# Altium schematic sheet Power.SchDoc
size B; Organization: Mechanart, LLC; Address1: 397 Laurie Meadows Drive; Address2: Apt. 437; Address3: San Mateo, CA 94403
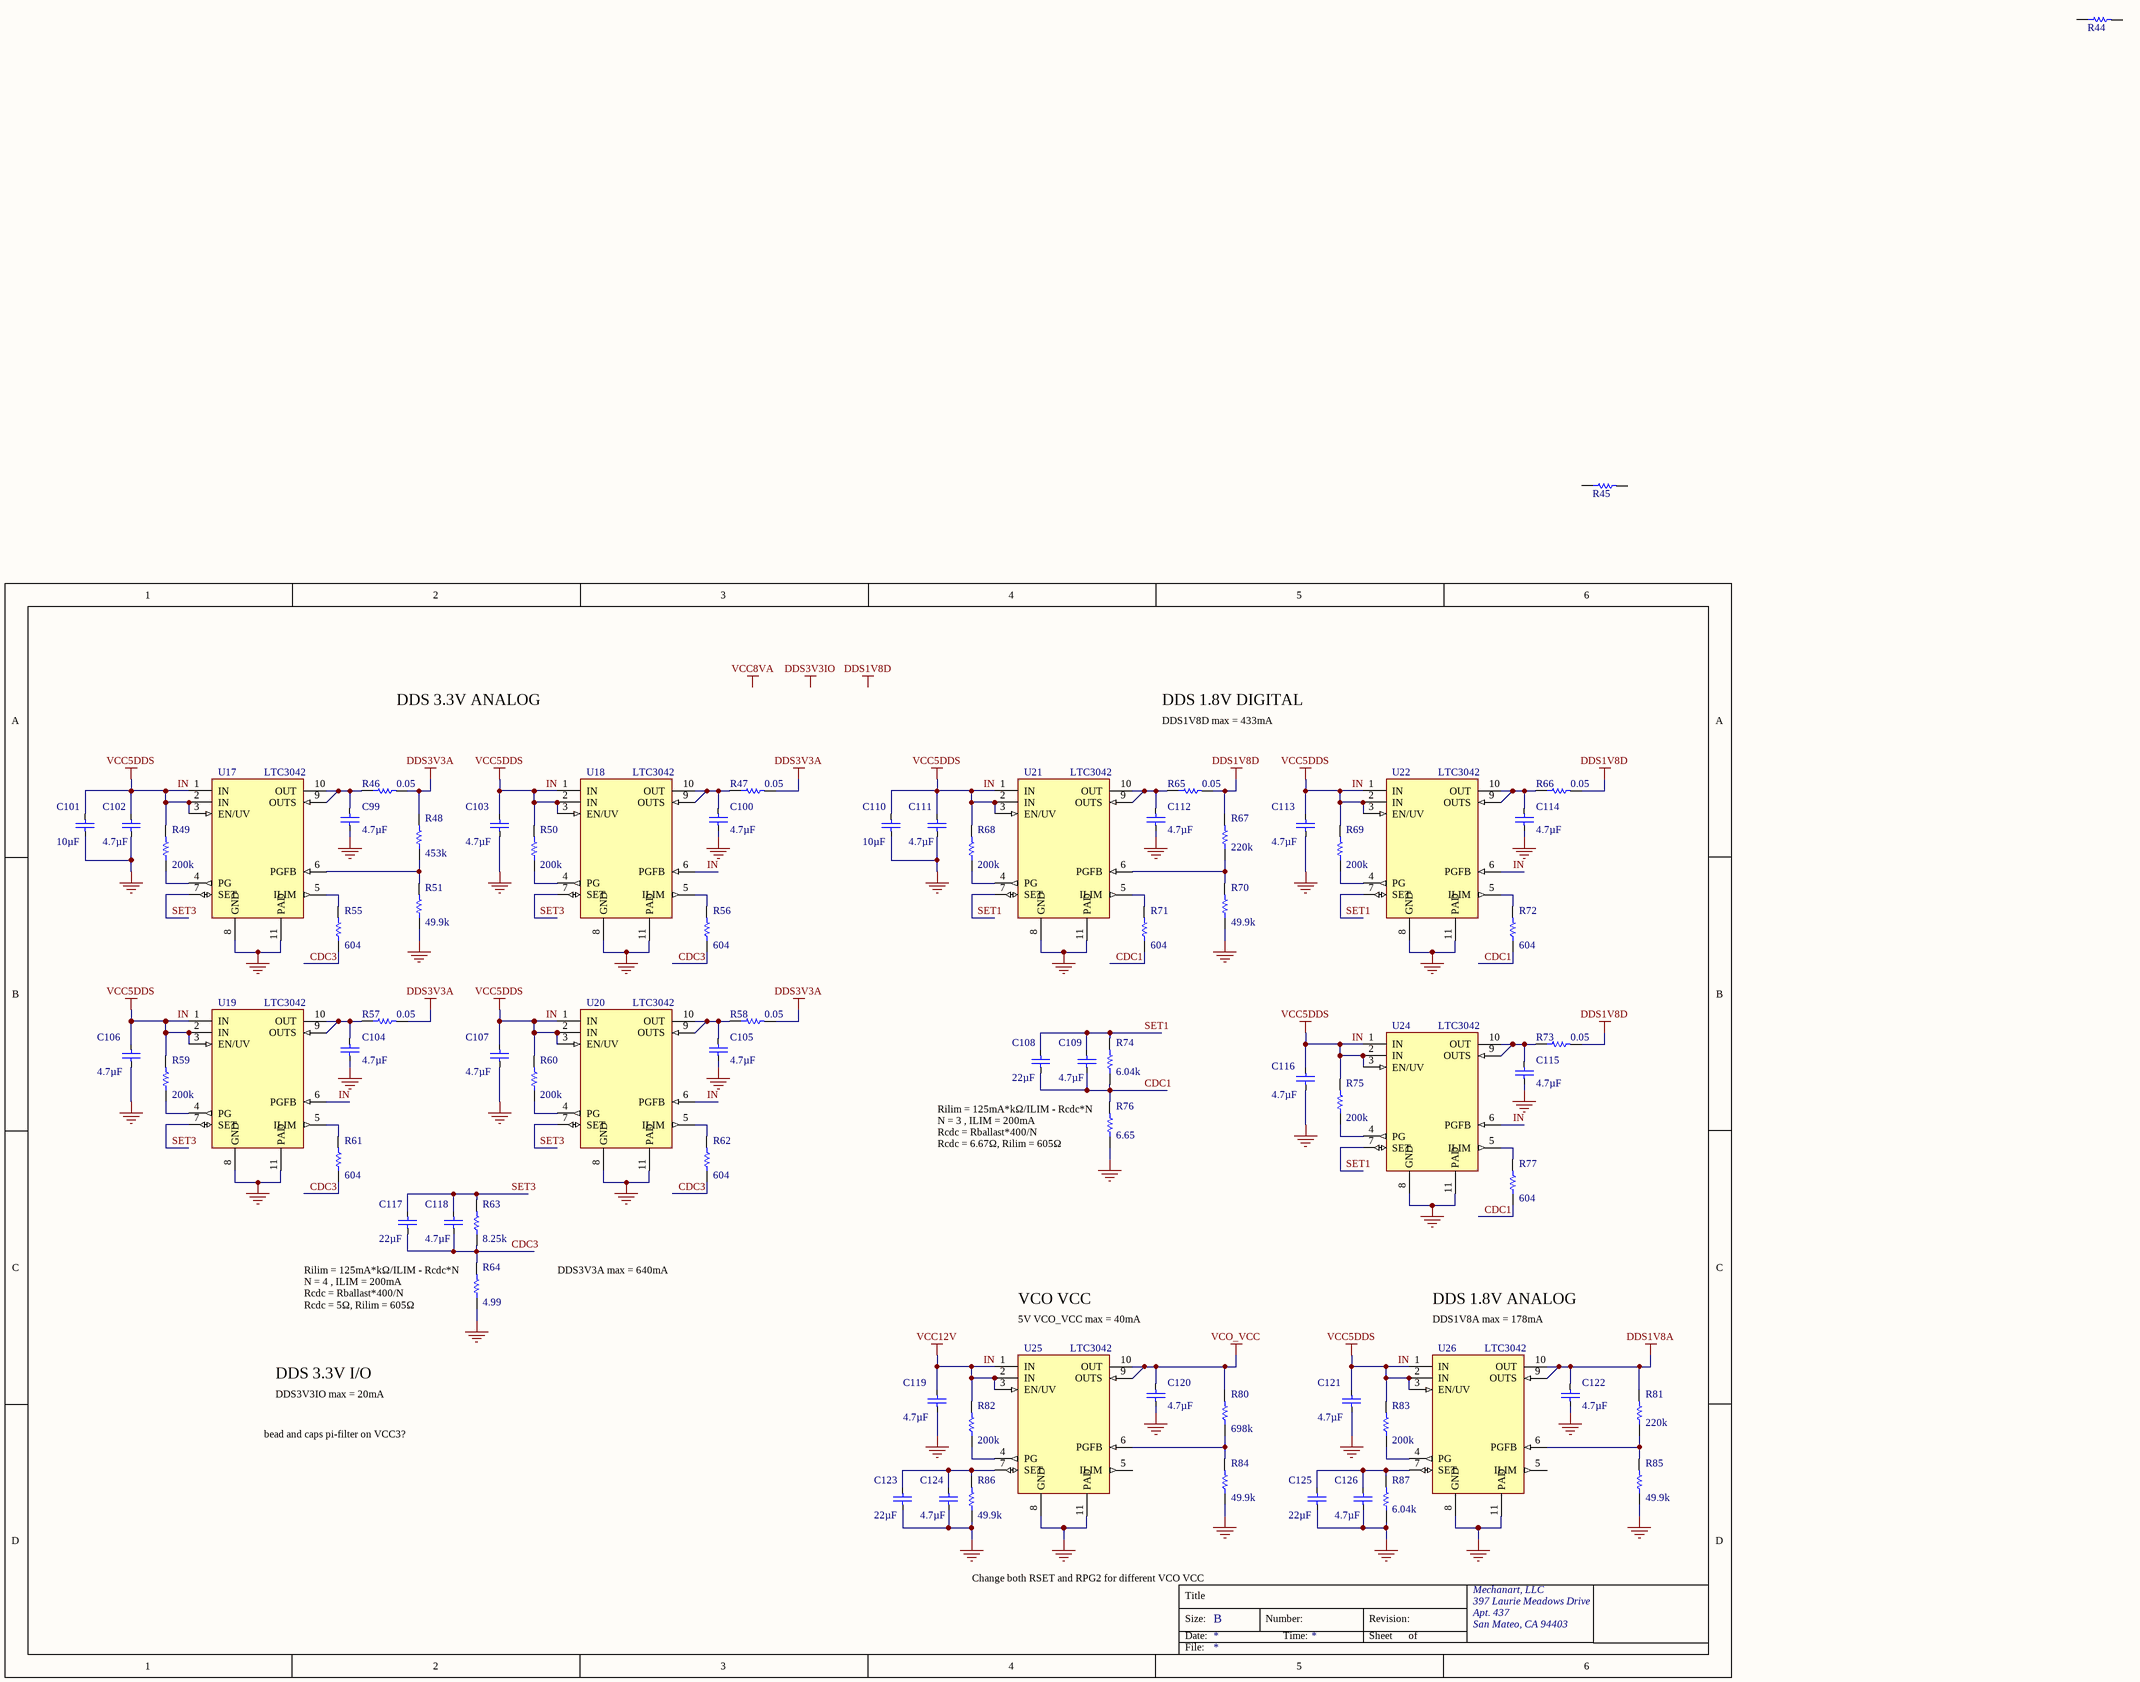
[diagram p0: Power.SchDoc]

## Parts
C99  4.7µF  [CAPC3216X160L55N]
C100  4.7µF  [CAPC3216X160L55N]
C101  10µF  [CAPC3216X160L55N]
C102  4.7µF  [CAPC3216X160L55N]
C103  4.7µF  [CAPC3216X160L55N]
C104  4.7µF  [CAPC3216X160L55N]
C105  4.7µF  [CAPC3216X160L55N]
C106  4.7µF  [CAPC3216X160L55N]
C107  4.7µF  [CAPC3216X160L55N]
C108  22µF  [CAPC2012X145L30N]
C109  4.7µF  [CAPC3216X160L55N]
C110  10µF  [CAPC3216X160L55N]
C111  4.7µF  [CAPC3216X160L55N]
C112  4.7µF  [CAPC3216X160L55N]
C113  4.7µF  [CAPC3216X160L55N]
C114  4.7µF  [CAPC3216X160L55N]
C115  4.7µF  [CAPC3216X160L55N]
C116  4.7µF  [CAPC3216X160L55N]
C117  22µF  [CAPC2012X145L30N]
C118  4.7µF  [CAPC3216X160L55N]
C119  4.7µF  [CAPC3216X160L55N]
C120  4.7µF  [CAPC3216X160L55N]
C121  4.7µF  [CAPC3216X160L55N]
C122  4.7µF  [CAPC3216X160L55N]
C123  22µF  [CAPC2012X145L30N]
C124  4.7µF  [CAPC3216X160L55N]
C125  22µF  [CAPC2012X145L30N]
C126  4.7µF  [CAPC3216X160L55N]
R44  0.05  [RESC_2012[0805]_N]  (value not drawn)
R45  8.25k  [RESC1608X45L30N]  (value not drawn)
R46  0.05  [RESC_2012[0805]_N]
R47  0.05  [RESC_2012[0805]_N]
R48  453k  [RESC1608X45L30N]
R49  200k  [RESC1608X45L30N]
R50  200k  [RESC1608X45L30N]
R51  49.9k  [RESC1608X45L30N]
R55  604  [RESC1608X45L30N]
R56  604  [RESC1608X45L30N]
R57  0.05  [RESC_2012[0805]_N]
R58  0.05  [RESC_2012[0805]_N]
R59  200k  [RESC1608X45L30N]
R60  200k  [RESC1608X45L30N]
R61  604  [RESC1608X45L30N]
R62  604  [RESC1608X45L30N]
R63  8.25k  [RESC1608X45L30N]
R64  4.99  [RESC1608X45L30N]
R65  0.05  [RESC_2012[0805]_N]
R66  0.05  [RESC_2012[0805]_N]
R67  220k  [RESC1608X45L30N]
R68  200k  [RESC1608X45L30N]
R69  200k  [RESC1608X45L30N]
R70  49.9k  [RESC1608X45L30N]
R71  604  [RESC1608X45L30N]
R72  604  [RESC1608X45L30N]
R73  0.05  [RESC_2012[0805]_N]
R74  6.04k  [RESC1608X45L30N]
R75  200k  [RESC1608X45L30N]
R76  6.65  [RESC1608X45L30N]
R77  604  [RESC1608X45L30N]
R80  698k  [RESC1608X45L30N]
R81  220k  [RESC1608X45L30N]
R82  200k  [RESC1608X45L30N]
R83  200k  [RESC1608X45L30N]
R84  49.9k  [RESC1608X45L30N]
R85  49.9k  [RESC1608X45L30N]
R86  49.9k  [RESC1608X45L30N]
R87  6.04k  [RESC1608X45L30N]
U17  LTC3042  [SON50P300X300X75-11T175X248L]
U18  LTC3042  [SON50P300X300X75-11T175X248L]
U19  LTC3042  [SON50P300X300X75-11T175X248L]
U20  LTC3042  [SON50P300X300X75-11T175X248L]
U21  LTC3042  [SON50P300X300X75-11T175X248L]
U22  LTC3042  [SON50P300X300X75-11T175X248L]
U24  LTC3042  [SON50P300X300X75-11T175X248L]
U25  LTC3042  [SON50P300X300X75-11T175X248L]
U26  LTC3042  [SON50P300X300X75-11T175X248L]

## Nets
DDS1V8A: C122.1 R81.2 U26.9(OUTS) U26.10(OUT)
DDS1V8D: R65.2 R66.2 R67.2 R73.2
DDS3V3A: R46.2 R47.2 R48.2 R57.2 R58.2
GND: C99.2 C100.2 C101.2 C102.2 C103.2 C104.2 C105.2 C106.2 C107.2 C110.2 C111.2 C112.2 C113.2 C114.2 C115.2 C116.2 C119.2 C120.2 C121.2 C122.2 C123.2 C124.2 C125.2 C126.2 R51.1 R64.1 R70.1 R76.1 R84.1 R85.1 R86.1 R87.1 U17.8(GND) U17.11(PAD) U18.8(GND) U18.11(PAD) U19.8(GND) U19.11(PAD) U20.8(GND) U20.11(PAD) U21.8(GND) U21.11(PAD) U22.8(GND) U22.11(PAD) U24.8(GND) U24.11(PAD) U25.8(GND) U25.11(PAD) U26.8(GND) U26.11(PAD)
IN: C101.1 C102.1 C103.1 C106.1 C107.1 C110.1 C111.1 C113.1 C116.1 C119.1 C121.1 R49.2 R50.2 R59.2 R60.2 R68.2 R69.2 R75.2 R82.2 R83.2 U17.1(IN) U17.2(IN) U17.3(EN/UV) U18.1(IN) U18.2(IN) U18.3(EN/UV) U18.6(PGFB) U19.1(IN) U19.2(IN) U19.3(EN/UV) U19.6(PGFB) U20.1(IN) U20.2(IN) U20.3(EN/UV) U20.6(PGFB) U21.1(IN) U21.2(IN) U21.3(EN/UV) U22.1(IN) U22.2(IN) U22.3(EN/UV) U22.6(PGFB) U24.1(IN) U24.2(IN) U24.3(EN/UV) U24.6(PGFB) U25.1(IN) U25.2(IN) U25.3(EN/UV) U26.1(IN) U26.2(IN) U26.3(EN/UV)  [also labelled VCC12V, VCC5DDS]
VCO_VCC: C120.1 R80.2 U25.9(OUTS) U25.10(OUT)
CDC1: C108.2 C109.2 R71.1 R72.1 R74.1 R76.2 R77.1
CDC3: C117.2 C118.2 R55.1 R56.1 R61.1 R62.1 R63.1 R64.2
SET1: C108.1 C109.1 R74.2 U21.7(SET) U22.7(SET) U24.7(SET)
SET3: C117.1 C118.1 R63.2 U17.7(SET) U18.7(SET) U19.7(SET) U20.7(SET)
NetC99_1: C99.1 R46.1 U17.9(OUTS) U17.10(OUT)
NetC100_1: C100.1 R47.1 U18.9(OUTS) U18.10(OUT)
NetC104_1: C104.1 R57.1 U19.9(OUTS) U19.10(OUT)
NetC105_1: C105.1 R58.1 U20.9(OUTS) U20.10(OUT)
NetC112_1: C112.1 R65.1 U21.9(OUTS) U21.10(OUT)
NetC114_1: C114.1 R66.1 U22.9(OUTS) U22.10(OUT)
NetC115_1: C115.1 R73.1 U24.9(OUTS) U24.10(OUT)
NetC123_1: C123.1 C124.1 R86.2 U25.7(SET)
NetC125_1: C125.1 C126.1 R87.2 U26.7(SET)
NetR48_1: R48.1 R51.2 U17.6(PGFB)
NetR49_1: R49.1 U17.4(PG)
NetR50_1: R50.1 U18.4(PG)
NetR55_2: R55.2 U17.5(ILIM)
NetR56_2: R56.2 U18.5(ILIM)
NetR59_1: R59.1 U19.4(PG)
NetR60_1: R60.1 U20.4(PG)
NetR61_2: R61.2 U19.5(ILIM)
NetR62_2: R62.2 U20.5(ILIM)
NetR67_1: R67.1 R70.2 U21.6(PGFB)
NetR68_1: R68.1 U21.4(PG)
NetR69_1: R69.1 U22.4(PG)
NetR71_2: R71.2 U21.5(ILIM)
NetR72_2: R72.2 U22.5(ILIM)
NetR75_1: R75.1 U24.4(PG)
NetR77_2: R77.2 U24.5(ILIM)
NetR80_1: R80.1 R84.2 U25.6(PGFB)
NetR81_1: R81.1 R85.2 U26.6(PGFB)
NetR82_1: R82.1 U25.4(PG)
NetR83_1: R83.1 U26.4(PG)

Not connected (* = marked no-connect by the designer): R44 1 2; R45 1 2; U25 5(ILIM); U26 5(ILIM)

## Notes on the sheet
- DDS 3.3V ANALOG
- DDS 1.8V DIGITAL
- DDS1V8D max = 433mA
- (near R76) Rilim = 125mA*kΩ/ILIM - Rcdc*N
  N = 3 , ILIM = 200mA
  Rcdc = Rballast*400/N
  Rcdc = 6.67Ω, Rilim = 605Ω
- (near R64) Rilim = 125mA*kΩ/ILIM - Rcdc*N
  N = 4 , ILIM = 200mA
  Rcdc = Rballast*400/N
  Rcdc = 5Ω, Rilim = 605Ω
- DDS3V3A max = 640mA
- VCO VCC
- (near U25) 5V VCO_VCC max = 40mA
- DDS 1.8V ANALOG
- (near U26) DDS1V8A max = 178mA
- DDS 3.3V I/O
- DDS3V3IO max = 20mA
- bead and caps pi-filter on VCC3?
- Change both RSET and RPG2 for different VCO VCC
- Labels drawn without touching a wire or pin: DDS1V8D, DDS3V3IO, VCC8VA
- Title
- Size:
- Date:
- B
- Number:
- Time:
- Revision:
- Sheet
- of
- File:

## Library data of the parts
C99 C100 C102-C107 C109 C111-C116 C118-C122 C124 C126 = GCM31CR71E475KA55L: CAP CER 4.7UF 25V X7R 1206; Manufacturer: Murata Electronics North America; Tolerance: ±10%; Design Item Id: GCM31CR71E475KA55L; Supplier 1: Digi-Key; Supplier Part Number 1: 490-4794-1-ND; Manufacturer Part Number: GCM31CR71E475KA55L; RoHS: RoHS Compliant; Category: Capacitors; Stock 1: 40626; Pricing 1: 1=0.52, 10=0.494, 25=0.35, 50=0.2948, 100=0.2395, 250=0.199, 500=0.18056, 1000=0.16583 (USD); Packaging: Cut Tape (CT); Applications: Automotive; Operating Temperature: -55°C ~ 125°C; Mounting Type: Surface Mount, MLCC; Package / Case: 1206 (3216 Metric); ComponentLink1URL: http://www.murata.com/products/catalog/pdf/c03e.pdf; ComponentLink1Description: http://www.murata.com/products/catalog/pdf/c03e.pdf; Capacitance: 4.7µF; Voltage - Rated: 25V; Temperature Coefficient: X7R; Ratings: AEC-Q200; Size / Dimension: 0.126" L x 0.063" W (3.20mm x 1.60mm); Height - Seated (Max): -; Thickness (Max): 0.071" (1.80mm); Lead Spacing: -; Features: -; Lead Style: -
C101 C110 = GRM31CR71E106KA12L: CAP CER 10UF 25V X7R 1206; Manufacturer: Murata Electronics North America; Tolerance: ±10%; Design Item Id: GRM31CR71E106KA12L; Supplier 1: Digi-Key; Supplier Part Number 1: 490-6518-1-ND; Manufacturer Part Number: GRM31CR71E106KA12L; RoHS: RoHS Compliant; Category: Capacitors; Stock 1: 157542; Pricing 1: 1=0.83, 10=0.706, 50=0.5194, 100=0.4129, 250=0.34632, 500=0.31302, 1000=0.28638 (USD); Packaging: Cut Tape (CT); Applications: General Purpose; Operating Temperature: -55°C ~ 125°C; Mounting Type: Surface Mount, MLCC; Package / Case: 1206 (3216 Metric); ComponentLink1URL: http://www.murata.com/~/media/webrenewal/support/library/catalog/products/capacitor/mlcc/c02e.pdf; ComponentLink1Description: http://www.murata.com/~/media/webrenewal/support/library/catalog/products/capacitor/mlcc/c02e.pdf; Capacitance: 10µF; Voltage - Rated: 25V; Temperature Coefficient: X7R; Ratings: -; Size / Dimension: 0.126" L x 0.063" W (3.20mm x 1.60mm); Height - Seated (Max): -; Thickness (Max): 0.071" (1.80mm); Lead Spacing: -; Features: -; Lead Style: -
C108 C117 C123 C125 = C2012X5R1C226K125AC: CAP CER 22UF 16V X5R 0805; Manufacturer: TDK Corporation; Tolerance: ±10%; Design Item Id: C2012X5R1C226K125AC; Supplier 1: Digi-Key; Supplier Part Number 1: 445-6797-1-ND; Manufacturer Part Number: C2012X5R1C226K125AC; RoHS: RoHS Compliant; Category: Capacitors; Stock 1: 448776; Pricing 1: 1=0.77, 10=0.737, 100=0.3575, 250=0.297, 500=0.2695, 1000=0.2475 (USD); Packaging: Cut Tape (CT); Applications: General Purpose; Operating Temperature: -55°C ~ 85°C; Mounting Type: Surface Mount, MLCC; Package / Case: 0805 (2012 Metric); ComponentLink1URL: https://product.tdk.com/info/en/catalog/datasheets/mlcc_commercial_general_en.pdf; ComponentLink1Description: https://product.tdk.com/info/en/catalog/datasheets/mlcc_commercial_general_en.pdf; Capacitance: 22µF; Voltage - Rated: 16V; Temperature Coefficient: X5R; Ratings: -; Size / Dimension: 0.079" L x 0.049" W (2.00mm x 1.25mm); Height - Seated (Max): -; Thickness (Max): 0.057" (1.45mm); Lead Spacing: -; Features: -; Lead Style: -
R44 R46 R47 R57 R58 R65 R66 R73 = WSL0805R0500FEA18: RES SMD 0.05 OHM 1% 1/4W 0805; Manufacturer: Vishay Dale; Power (Watts): 0.25W, 1/4W; Temperature Coefficient: ±75ppm/°C; Resistance: 0.05; Design Item Id: WSL0805R0500FEA18; Supplier 1: Digi-Key; Supplier Part Number 1: WSLB-.05CT-ND; Manufacturer Part Number: WSL0805R0500FEA18; RoHS: RoHS Compliant; Category: Resistors; Stock 1: 6290; Pricing 1: 1=1, 10=0.887, 25=0.8152, 50=0.7436, 100=0.6435, 250=0.5434, 500=0.4576, 1000=0.38038, 2500=0.3718 (USD); Packaging: Cut Tape (CT); Operating Temperature: -65°C ~ 170°C; Package / Case: 0805 (2012 Metric); Supplier Device Package: 0805; ComponentLink1URL: http://www.vishay.com/docs/31057/wslhigh.pdf; ComponentLink1Description: http://www.vishay.com/docs/31057/wslhigh.pdf; Tolerance: ±1%; Composition: Metal Element; Features: Current Sense, Moisture Resistant, Pulse Withstanding; Size / Dimension: 0.080" L x 0.050" W (2.03mm x 1.27mm); Height: 0.018" (0.46mm); Number of Terminations: 2
R45 R63 = CRCW06038K25FKEA: RES SMD 8.25K OHM 1% 1/10W 0603; Manufacturer: Vishay Dale; Power (Watts): 0.1W, 1/10W; Temperature Coefficient: ±100ppm/°C; Resistance: 8.25k; Design Item Id: CRCW06038K25FKEA; Supplier 1: Digi-Key; Supplier Part Number 1: 541-8.25KHCT-ND; Manufacturer Part Number: CRCW06038K25FKEA; RoHS: RoHS Compliant; Category: Resistors; Stock 1: 15435; Pricing 1: 10=0.081, 50=0.0436, 200=0.0251, 1000=0.01711 (USD); Packaging: Cut Tape (CT); Operating Temperature: -55°C ~ 155°C; Package / Case: 0603 (1608 Metric); Supplier Device Package: 0603 (1608 Metric); ComponentLink1URL: http://www.vishay.com/docs/20035/dcrcwe3.pdf; ComponentLink1Description: http://www.vishay.com/docs/20035/dcrcwe3.pdf; Tolerance: ±1%; Composition: Thick Film; Features: Automotive AEC-Q200; Size / Dimension: 0.061" L x 0.033" W (1.55mm x 0.85mm); Height: 0.020" (0.50mm); Number of Terminations: 2
R48 = CRCW0603453KFKEA: RES SMD 453K OHM 1% 1/10W 0603; Manufacturer: Vishay Dale; Power (Watts): 0.1W, 1/10W; Temperature Coefficient: ±100ppm/°C; Resistance: 453k; Design Item Id: CRCW0603453KFKEA; Footprint: RESC_1608[0603]_N; Supplier 1: Digi-Key; Supplier Part Number 1: 541-453KHCT-ND; Manufacturer Part Number: CRCW0603453KFKEA; RoHS: RoHS Compliant; Category: Resistors; Stock 1: 26923; Pricing 1: 10=0.081, 50=0.0436, 200=0.0251, 1000=0.01711 (USD); Packaging: Cut Tape (CT); Operating Temperature: -55°C ~ 155°C; Package / Case: 0603 (1608 Metric); Supplier Device Package: 0603 (1608 Metric); ComponentLink1URL: http://www.vishay.com/docs/20035/dcrcwe3.pdf; ComponentLink1Description: http://www.vishay.com/docs/20035/dcrcwe3.pdf; Tolerance: ±1%; Composition: Thick Film; Features: Automotive AEC-Q200; Size / Dimension: 0.061" L x 0.033" W (1.55mm x 0.85mm); Height: 0.020" (0.50mm); Number of Terminations: 2
R49 R50 R59 R60 R68 R69 R75 R82 R83 = CRCW0603200KFKEA: RES SMD 200K OHM 1% 1/10W 0603; Manufacturer: Vishay Dale; Power (Watts): 0.1W, 1/10W; Temperature Coefficient: ±100ppm/°C; Resistance: 200k; Design Item Id: CRCW0603200KFKEA; Supplier 1: Digi-Key; Supplier Part Number 1: 541-200KHCT-ND; Manufacturer Part Number: CRCW0603200KFKEA; RoHS: RoHS Compliant; Category: Resistors; Stock 1: 228048; Pricing 1: 10=0.081, 50=0.0436, 200=0.0251, 1000=0.01711 (USD); Packaging: Cut Tape (CT); Operating Temperature: -55°C ~ 155°C; Package / Case: 0603 (1608 Metric); Supplier Device Package: 0603 (1608 Metric); ComponentLink1URL: http://www.vishay.com/docs/20035/dcrcwe3.pdf; ComponentLink1Description: http://www.vishay.com/docs/20035/dcrcwe3.pdf; Tolerance: ±1%; Composition: Thick Film; Features: Automotive AEC-Q200; Size / Dimension: 0.061" L x 0.033" W (1.55mm x 0.85mm); Height: 0.020" (0.50mm); Number of Terminations: 2
R51 R70 R84-R86 = CRCW060349K9FKEA: RES SMD 49.9K OHM 1% 1/10W 0603; Manufacturer: Vishay Dale; Power (Watts): 0.1W, 1/10W; Temperature Coefficient: ±100ppm/°C; Resistance: 49.9k; Design Item Id: CRCW060349K9FKEA; Supplier 1: Digi-Key; Supplier Part Number 1: 541-49.9KHCT-ND; Manufacturer Part Number: CRCW060349K9FKEA; RoHS: RoHS Compliant; Category: Resistors; Stock 1: 147485; Pricing 1: 10=0.081, 50=0.0436, 200=0.0251, 1000=0.01711 (USD); Packaging: Cut Tape (CT); Operating Temperature: -55°C ~ 155°C; Package / Case: 0603 (1608 Metric); Supplier Device Package: 0603 (1608 Metric); ComponentLink1URL: http://www.vishay.com/docs/20035/dcrcwe3.pdf; ComponentLink1Description: http://www.vishay.com/docs/20035/dcrcwe3.pdf; Tolerance: ±1%; Composition: Thick Film; Features: Automotive AEC-Q200; Size / Dimension: 0.061" L x 0.033" W (1.55mm x 0.85mm); Height: 0.020" (0.50mm); Number of Terminations: 2
R55 R56 R61 R62 R71 R72 R77 = CRCW0603604RFKEA: RES SMD 604 OHM 1% 1/10W 0603; Manufacturer: Vishay Dale; Power (Watts): 0.1W, 1/10W; Temperature Coefficient: ±100ppm/°C; Resistance: 604; Design Item Id: CRCW0603604RFKEA; Supplier 1: Digi-Key; Supplier Part Number 1: 541-604HCT-ND; Manufacturer Part Number: CRCW0603604RFKEA; RoHS: RoHS Compliant; Category: Resistors; Stock 1: 19900; Pricing 1: 10=0.081, 50=0.0436, 200=0.0251, 1000=0.01711 (USD); Packaging: Cut Tape (CT); Operating Temperature: -55°C ~ 155°C; Package / Case: 0603 (1608 Metric); Supplier Device Package: 0603 (1608 Metric); ComponentLink1URL: http://www.vishay.com/docs/20035/dcrcwe3.pdf; ComponentLink1Description: http://www.vishay.com/docs/20035/dcrcwe3.pdf; Tolerance: ±1%; Composition: Thick Film; Features: Automotive AEC-Q200; Size / Dimension: 0.061" L x 0.033" W (1.55mm x 0.85mm); Height: 0.020" (0.50mm); Number of Terminations: 2
R64 = CRCW06034R99FKEA: RES SMD 4.99 OHM 1% 1/10W 0603; Manufacturer: Vishay Dale; Power (Watts): 0.1W, 1/10W; Temperature Coefficient: ±100ppm/°C; Resistance: 4.99; Design Item Id: CRCW06034R99FKEA; Supplier 1: Digi-Key; Supplier Part Number 1: 541-4.99HHCT-ND; Manufacturer Part Number: CRCW06034R99FKEA; RoHS: RoHS Compliant; Category: Resistors; Stock 1: 17452; Pricing 1: 10=0.081, 50=0.0436, 200=0.0251, 1000=0.01711 (USD); Packaging: Cut Tape (CT); Operating Temperature: -55°C ~ 155°C; Package / Case: 0603 (1608 Metric); Supplier Device Package: 0603 (1608 Metric); ComponentLink1URL: http://www.vishay.com/docs/20035/dcrcwe3.pdf; ComponentLink1Description: http://www.vishay.com/docs/20035/dcrcwe3.pdf; Tolerance: ±1%; Composition: Thick Film; Features: Automotive AEC-Q200; Size / Dimension: 0.061" L x 0.033" W (1.55mm x 0.85mm); Height: 0.020" (0.50mm); Number of Terminations: 2
R67 R81 = CRCW0603220KFKEA: RES SMD 220K OHM 1% 1/10W 0603; Manufacturer: Vishay Dale; Power (Watts): 0.1W, 1/10W; Temperature Coefficient: ±100ppm/°C; Resistance: 220k; Design Item Id: CRCW0603220KFKEA; Supplier 1: Digi-Key; Supplier Part Number 1: 541-220KHCT-ND; Manufacturer Part Number: CRCW0603220KFKEA; RoHS: RoHS Compliant; Category: Resistors; Stock 1: 49454; Pricing 1: 10=0.081, 50=0.0436, 200=0.0251, 1000=0.01711 (USD); Packaging: Cut Tape (CT); Operating Temperature: -55°C ~ 155°C; Package / Case: 0603 (1608 Metric); Supplier Device Package: 0603 (1608 Metric); ComponentLink1URL: http://www.vishay.com/docs/20035/dcrcwe3.pdf; ComponentLink1Description: http://www.vishay.com/docs/20035/dcrcwe3.pdf; Tolerance: ±1%; Composition: Thick Film; Features: Automotive AEC-Q200; Size / Dimension: 0.061" L x 0.033" W (1.55mm x 0.85mm); Height: 0.020" (0.50mm); Number of Terminations: 2
R74 R87 = CRCW06036K04FKEA: RES SMD 6.04K OHM 1% 1/10W 0603; Manufacturer: Vishay Dale; Power (Watts): 0.1W, 1/10W; Temperature Coefficient: ±100ppm/°C; Resistance: 6.04k; Design Item Id: CRCW06036K04FKEA; Supplier 1: Digi-Key; Supplier Part Number 1: 541-6.04KHCT-ND; Manufacturer Part Number: CRCW06036K04FKEA; RoHS: RoHS Compliant; Category: Resistors; Stock 1: 50865; Pricing 1: 10=0.081, 50=0.0436, 200=0.0251, 1000=0.01711 (USD); Packaging: Cut Tape (CT); Operating Temperature: -55°C ~ 155°C; Package / Case: 0603 (1608 Metric); Supplier Device Package: 0603 (1608 Metric); ComponentLink1URL: http://www.vishay.com/docs/20035/dcrcwe3.pdf; ComponentLink1Description: http://www.vishay.com/docs/20035/dcrcwe3.pdf; Tolerance: ±1%; Composition: Thick Film; Features: Automotive AEC-Q200; Size / Dimension: 0.061" L x 0.033" W (1.55mm x 0.85mm); Height: 0.020" (0.50mm); Number of Terminations: 2
R76 = CRCW06036R65FKEA: RES SMD 6.65 OHM 1% 1/10W 0603; Manufacturer: Vishay Dale; Power (Watts): 0.1W, 1/10W; Temperature Coefficient: ±100ppm/°C; Resistance: 6.65; Design Item Id: CRCW06036R65FKEA; Supplier 1: Digi-Key; Supplier Part Number 1: 541-6.65HHCT-ND; Manufacturer Part Number: CRCW06036R65FKEA; RoHS: RoHS Compliant; Category: Resistors; Stock 1: 4954; Pricing 1: 10=0.081, 50=0.0436, 200=0.0251, 1000=0.01711 (USD); Packaging: Cut Tape (CT); Operating Temperature: -55°C ~ 155°C; Package / Case: 0603 (1608 Metric); Supplier Device Package: 0603 (1608 Metric); ComponentLink1URL: http://www.vishay.com/docs/20035/dcrcwe3.pdf; ComponentLink1Description: http://www.vishay.com/docs/20035/dcrcwe3.pdf; Tolerance: ±1%; Composition: Thick Film; Features: Automotive AEC-Q200; Size / Dimension: 0.061" L x 0.033" W (1.55mm x 0.85mm); Height: 0.020" (0.50mm); Number of Terminations: 2
R80 = CRCW0603698KFKEA: RES SMD 698K OHM 1% 1/10W 0603; Manufacturer: Vishay Dale; Power (Watts): 0.1W, 1/10W; Temperature Coefficient: ±100ppm/°C; Resistance: 698k; Design Item Id: CRCW0603698KFKEA; Supplier 1: Digi-Key; Supplier Part Number 1: 541-698KHCT-ND; Manufacturer Part Number: CRCW0603698KFKEA; RoHS: RoHS Compliant; Category: Resistors; Stock 1: 13875; Pricing 1: 10=0.081, 50=0.0436, 200=0.0251, 1000=0.01711 (USD); Packaging: Cut Tape (CT); Operating Temperature: -55°C ~ 155°C; Package / Case: 0603 (1608 Metric); Supplier Device Package: 0603 (1608 Metric); ComponentLink1URL: http://www.vishay.com/docs/20035/dcrcwe3.pdf; ComponentLink1Description: http://www.vishay.com/docs/20035/dcrcwe3.pdf; Tolerance: ±1%; Composition: Thick Film; Features: Automotive AEC-Q200; Size / Dimension: 0.061" L x 0.033" W (1.55mm x 0.85mm); Height: 0.020" (0.50mm); Number of Terminations: 2
U17-U22 U24-U26 = LT3042EDD#PBF: IC REG LDO ADJ 0.2A 10DFN; Manufacturer: Linear Technology; Voltage - Output: 0 V ~ 15 V; Voltage - Input: 1.8 V ~ 20 V; Current - Output: 200mA; Regulator Topology: Positive Adjustable; Voltage - Dropout (Typical): 0.35V @ 200mA; Number of Regulators: 1; Current - Limit (Min): 220mA; Design Item Id: LT3042EDD#PBF; Supplier 1: Digi-Key; Supplier Part Number 1: LT3042EDD#PBF-ND; Manufacturer Part Number: LT3042EDD#PBF; RoHS: RoHS Compliant; Category: Integrated Circuits (ICs); Stock 1: 2998; Pricing 1: 1=4.9, 25=3.2532, 100=2.73 (USD); Packaging: Tube; Operating Temperature: -40°C ~ 125°C; Mounting Type: Surface Mount; Package / Case: 10-WFDFN Exposed Pad; Supplier Device Package: 10-DFN (3x3); ComponentLink1URL: http://www.linear.com/docs/46159; ComponentLink1Description: http://www.linear.com/docs/46159